# EAGLE design voltage_converter (EAGLE 9.6.2)
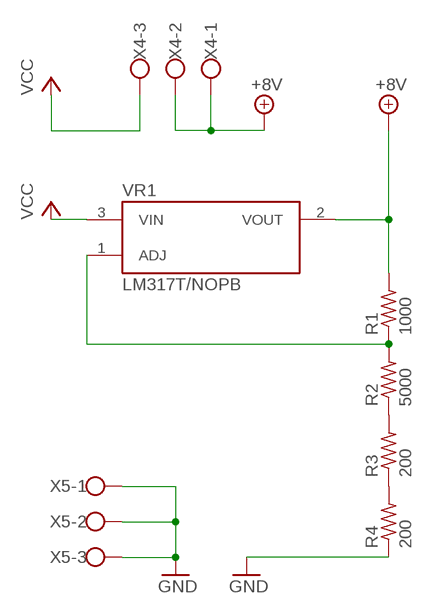
[diagram p0: schematic, sheet 1]

## Parts
R1  1000  R-US_0204/5  [0204/5]
R2  5000  R-US_0204/5  [0204/5]
R3  200  R-US_0204/5  [0204/5]
R4  200  R-US_0204/5  [0204/5]
VR1  LM317T/NOPB  [TO254P1054X470X1955-3]
X4  W237-103  [W237-103]
X5  W237-103  [W237-103]

## Nets
+8V: R1.2 VR1.2(VOUT) X4.1 X4.2
GND: R4.1 X5.1 X5.2 X5.3
N$1: R3.1 R4.2
N$2: R2.1 R3.2
N$3: R1.1 R2.2 VR1.1(ADJ)
VCC: VR1.3(VIN) X4.3

## Library data of the parts
R1-R4 = rcl:R-US_: RESISTOR, American symbol; SPICEPREFIX: R
VR1 = chmip:LM317T/NOPB: Check availability <https://pricing.snapeda.com/parts/LM317T/NOPB/Texas%20Instruments/view-part?ref=eda>; AVAILABILITY: In Stock; CHECK_PRICES: https://www.snapeda.com/parts/LM317T/NOPB/Texas+Instruments/view-part/?ref=eda; DESCRIPTION: 1.5-A, 40-V, adjustable linear voltage regulator; MF: Texas Instruments; MP: LM317T/NOPB; PACKAGE: TO-220-3 Texas Instruments; PRICE: None; PURCHASE-URL: https://www.snapeda.com/api/url_track_click_mouser/?unipart_id=358009&manufacturer=Texas Instruments&part_name=LM317T/NOPB&search_term=None; SNAPEDA_LINK: https://www.snapeda.com/parts/LM317T/NOPB/Texas+Instruments/view-part/?ref=snap
X4 X5 = con-wago-500:W237-103: WAGO SCREW CLAMP; MPN: 237-103; OC_FARNELL: unknown; OC_NEWARK: 18M7116

## Board
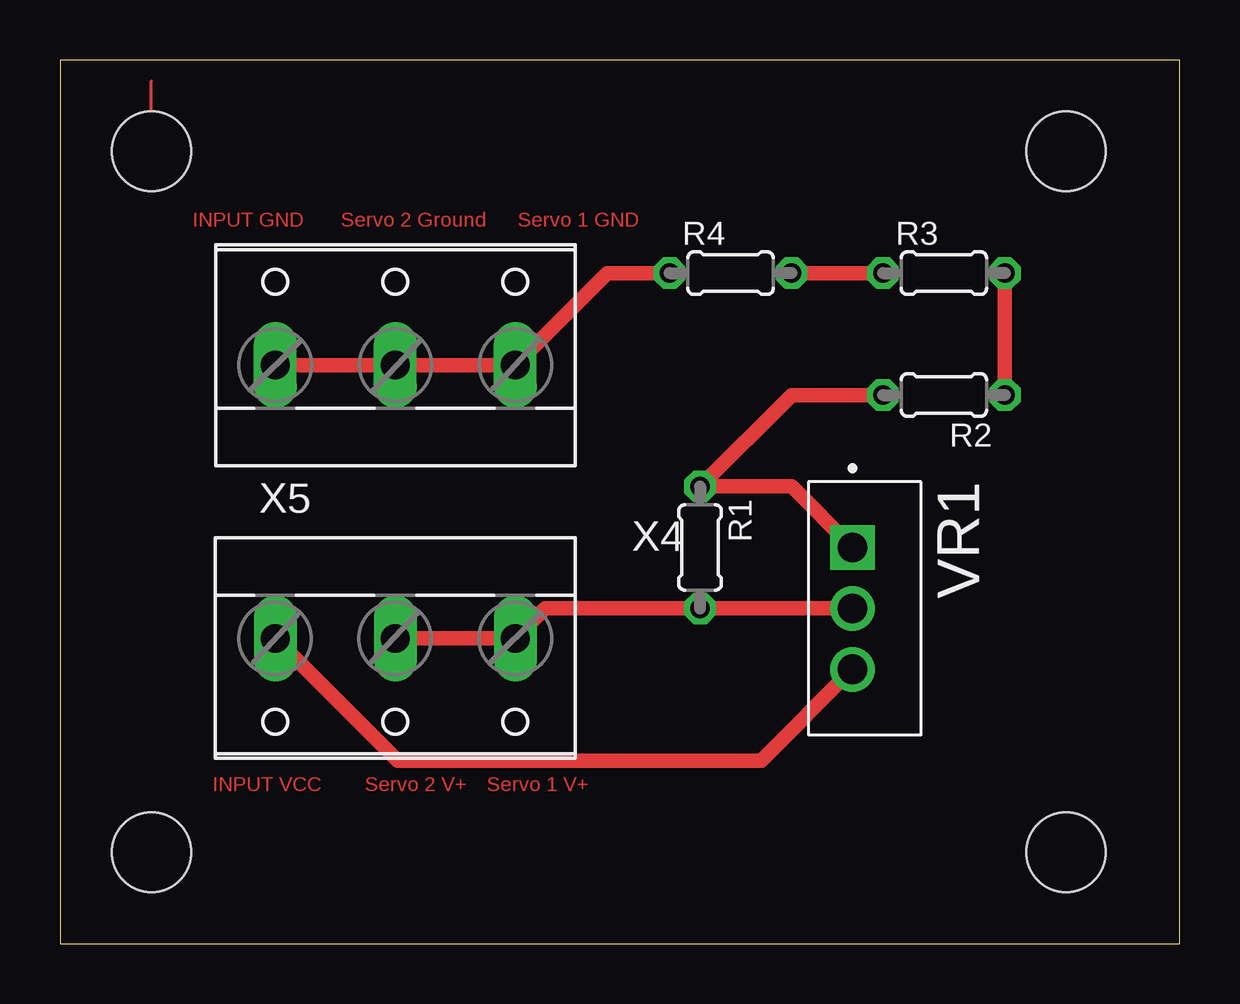
[diagram p1: board, top side]

Size 46.66 x 36.82 mm. Coordinates in mm from the lower left corner, seen from the top.
Outline: 0,0 46.66,0 46.66,36.82 0,36.82 0,0
Copper layers (1*16): Top 0.035mm / dielectric 1.5mm / Bottom 0.035mm
Design rules "default": minimum track width 6mil, minimum drill 0.35mm, track to track 6mil, track to pad 6mil, pad to pad 6mil, via to via 6mil, smd to smd 6mil, copper to edge 40mil, drill to drill 6mil, minimum pad ring 10mil, minimum via ring 8mil, stop-mask expansion 4mil, vias tented up to drill 0mil, thermal gap 10mil
Holes 3.3 mm at 3.81,33.02 41.91,33.02 3.81,3.81 41.91,3.81

### Footprints (pad centres in the part's own frame; a part is rotated, then mirrored left to right if it is on the bottom)
0204/5 = drill 0.813 octagon: 1 -2.54,0; 2 2.54,0
TO254P1054X470X1955-3 = drill 1.24 square: 1 -2.54,0 | drill 1.24: 2 0,0; 3 2.54,0
W237-103 = drill 1.194 long: 1 -5,-1.29; 2 0,-1.29; 3 5,-1.29

### Placement (x,y rotation side)
R1  26.67,16.51 270 top
R2  36.83,22.86 180 top
R3  36.83,27.94 0 top
R4  27.94,27.94 0 top
VR1  33.02,13.97 270 top
X4  13.97,11.43 180 top
X5  13.97,25.4 0 top

### Tracks (layer width: path | path; a pad name or v marks a point on that pad's centre or on a via)
+8V
  Top 0.61: VR1.2 R1.2 20.22,13.97 X4.1 X4.2
GND
  Top 0.61: X5.1 X5.2 X5.3 22.8,27.94 R4.1
N$1
  Top 0.61: R3.1 R4.2
N$2
  Top 0.61: R3.2 R2.1
N$3
  Top 0.61: VR1.1 30.48,19.05 R1.1 30.48,22.86 R2.2
VCC
  Top 0.61: X4.3 14.07,7.62 29.21,7.62 VR1.3
(copper drawn outside any net)
  shapes: Top area x1

### Text on the board
Top: INPUT GND | Servo 2 Ground | Servo 1 GND | INPUT VCC | Servo 2 V+ | Servo 1 V+